# EAGLE design Main (EAGLE 7.5.0)

## Sheet 1 of 2
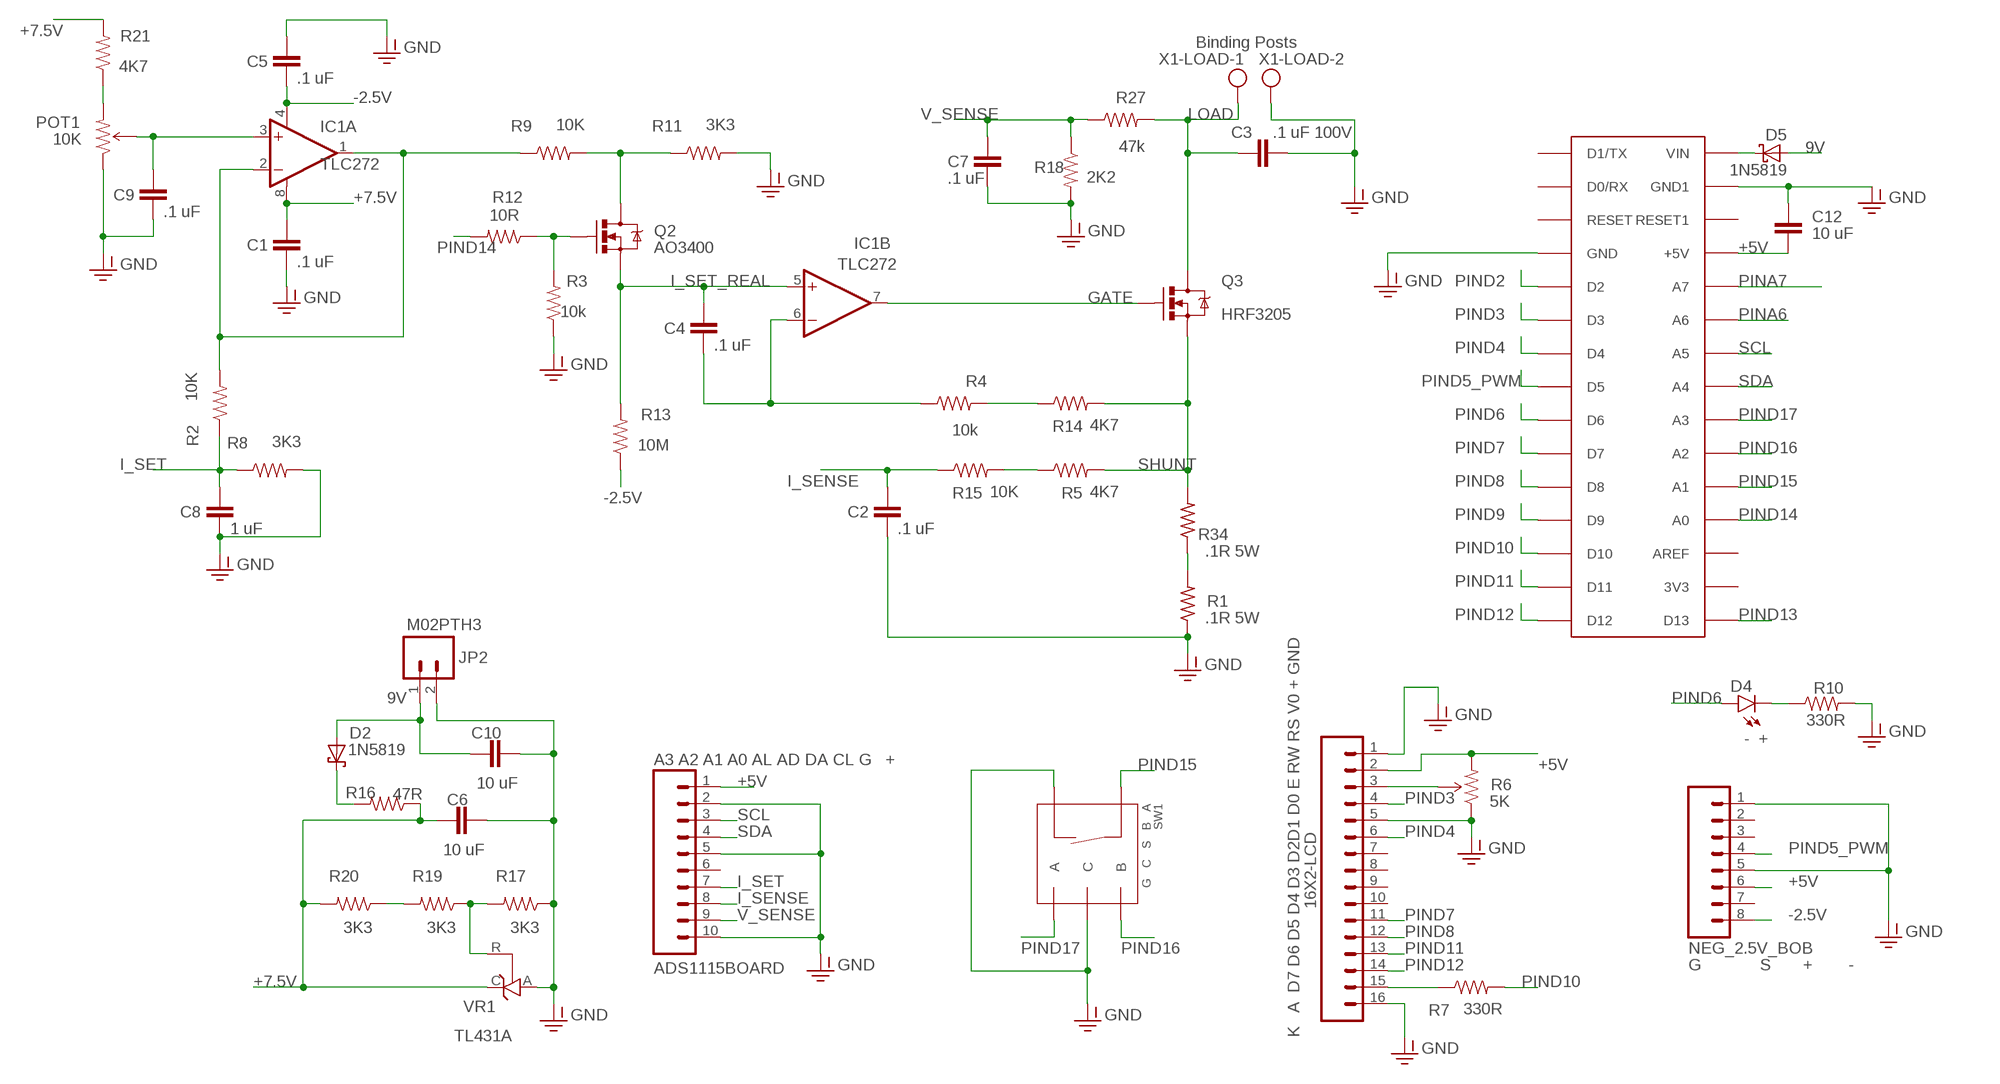
[diagram p0: schematic, sheet 1]

### Parts
16X2-LCD  K A D7 D6 D5 D4 D3 D2D1 D0 E RW RS V0 + GND  M16PTH  [1X16]
ADS1115BOARD  A3 A2 A1 A0 AL AD DA CL G +  M10NO_SILK_PTH_FEMALE  [1X10_NO_SILK]
ARDUINO_NANO  NANO  ARDUINONANO  [PDIP-32]
C1  .1 uF  CAPPTH1  [CAP-PTH-5MM]
C2  .1 uF  CAPPTH1  [CAP-PTH-5MM]
C3  .1 uF 100V  CAPPTH1  [CAP-PTH-5MM]
C4  .1 uF  CAPPTH1  [CAP-PTH-5MM]
C5  .1 uF  CAPPTH1  [CAP-PTH-5MM]
C6  10 uF  CAPPTH1  [CAP-PTH-5MM]
C7  .1 uF  CAPPTH1  [CAP-PTH-5MM]
C8  1 uF  CAPPTH1  [CAP-PTH-5MM]
C9  .1 uF  CAPPTH1  [CAP-PTH-5MM]
C10  10 uF  CAPPTH1  [CAP-PTH-5MM]
C12  10 uF  CAPPTH1  [CAP-PTH-5MM]
D2  1N5819  [DO41-10]
D4  - +  LED5MM  [LED5MM]
D5  1N5819  [DO41-10]
IC1  TLC272  OPAMP-DUALDIP  [DIP08]
JP2  M02PTH3  [1X02_LONGPADS]
NEG_2.5V_BOB  G S + -  M08  [1X08_ROUND]
POT1  10K  TRIMPOT-PTH-KNOB  [3386U]
Q2  AO3400  MOSFET-NCHANNELBSS123LT1G  [SOT23-3]
Q3  HRF3205  MOSFET-NCHANNELFQP30N06L  [TO220V]
R1  .1R 5W  R-US_VTA53  [VTA53]
R2  10K  RESISTORPTH-1/4W  [AXIAL-0.4]
R3  10k  RESISTORPTH-1/4W  [AXIAL-0.4]
R4  10k  RESISTORPTH-1/4W  [AXIAL-0.4]
R5  4K7  RESISTORPTH-1/4W  [AXIAL-0.4]
R6  5K  TRIMPOTPTH  [TRIM_POT_PTH]
R7  330R  RESISTORPTH-1/4W  [AXIAL-0.4]
R8  3K3  RESISTORPTH-1/2W  [AXIAL-0.5]
R9  10K  RESISTORPTH-1/4W  [AXIAL-0.4]
R10  330R  RESISTORPTH-1/4W  [AXIAL-0.4]
R11  3K3  RESISTORPTH-1/4W  [AXIAL-0.4]
R12  10R  RESISTORPTH-1/4W  [AXIAL-0.4]
R13  10M  RESISTORPTH-1/2W  [AXIAL-0.5]
R14  4K7  RESISTORPTH-1/4W  [AXIAL-0.4]
R15  10K  RESISTORPTH-1/2W  [AXIAL-0.5]
R16  47R  RESISTORPTH-1/4W  [AXIAL-0.4]
R17  3K3  RESISTORPTH-1/4W  [AXIAL-0.4]
R18  2K2  RESISTORPTH-1/4W  [AXIAL-0.4]
R19  3K3  RESISTORPTH-1/4W  [AXIAL-0.4]
R20  3K3  RESISTORPTH-1/4W  [AXIAL-0.4]
R21  4K7  RESISTORPTH-1/4W  [AXIAL-0.4]
R27  47k  RESISTORPTH-1/2W  [AXIAL-0.5]
R34  .1R 5W  R-US_VTA53  [VTA53]
SW1  G C S B A  ROTARTY_ENCODERROTARY_ENC_HDR  [1X05]
VR1  TL431A  TL431CLP  [TO92-CLP]
X1-LOAD  Binding Posts  W237-102  [W237-102]

### Nets
9V: C10.1 D2.A D5.A JP2.1 ; also sheet 2
+5V: 16X2-LCD.2 ADS1115BOARD.1 ARDUINO_NANO.+5V C12.1 NEG_2.5V_BOB.6 R6.3(CW) ; also sheet 2
+7.5V: C1.1 C6.1 IC1.8(A:V+) R16.P$1 R20.P$2 R21.P$2 VR1.C ; also sheet 2
-2.5V: C5.2 IC1.4(A:V-) NEG_2.5V_BOB.8 R13.P$1 ; also sheet 2
GATE: IC1.7(B:OUT) Q3.1(G) ; also sheet 2
GND-ISO: 16X2-LCD.1 16X2-LCD.5 16X2-LCD.16 ADS1115BOARD.2 ADS1115BOARD.5 ADS1115BOARD.10 ARDUINO_NANO.GND ARDUINO_NANO.GND1 C1.2 C2.2 C3.2 C5.1 C6.2 C7.2 C8.2 C9.2 C10.2 C12.2 JP2.2 NEG_2.5V_BOB.1 NEG_2.5V_BOB.5 POT1.1(CCW) R1.1 R3.P$1 R6.1(CCW) R8.P$2 R10.P$2 R11.P$2 R17.P$1 R18.P$2 SW1.1(SW-) SW1.2(C) VR1.A X1-LOAD.2 ; supply symbol labelled GND ; also sheet 2
I_SENSE: ADS1115BOARD.8 C2.1 R15.P$1
I_SET: ADS1115BOARD.7 C8.1 R2.P$1 R8.P$1 ; also sheet 2
I_SET_REAL: C4.1 IC1.5(B:+IN) Q2.2(S) R13.P$2 ; also sheet 2
LOAD: C3.1 Q3.2(D) R27.P$2 X1-LOAD.1 ; also sheet 2
N$1: R1.2 R34.1
N$2: 16X2-LCD.15 R7.P$1
N$3: R4.P$2 R14.P$1
N$5: 16X2-LCD.3 R6.2(WIPER)
N$8: C9.1 IC1.3(A:+IN) POT1.2(WIPER)
N$9: D2.C R16.P$2
N$10: IC1.1(A:OUT) IC1.2(A:-IN) R2.P$2 R9.P$1
N$11: ARDUINO_NANO.VIN D5.C
N$13: Q2.3(D) R9.P$2 R11.P$1
N$14: R5.P$1 R15.P$2
N$15: Q2.1(G) R3.P$2 R12.P$1
N$16: D4.K(C) R10.P$1
N$17: POT1.3(CW) R21.P$1
N$18: R17.P$2 R19.P$1 VR1.R
N$19: R19.P$2 R20.P$1
N$23: C4.2 IC1.6(B:-IN) R4.P$1
PINA6: ARDUINO_NANO.A1(A6) ; also sheet 2
PINA7: ARDUINO_NANO.A0(A7) ; also sheet 2
PIND2: ARDUINO_NANO.D2 ; also sheet 2
PIND3: 16X2-LCD.4 ARDUINO_NANO.D3
PIND4: 16X2-LCD.6 ARDUINO_NANO.D4
PIND5_PWM: ARDUINO_NANO.D5 NEG_2.5V_BOB.4
PIND6: ARDUINO_NANO.D6 D4.A
PIND7: 16X2-LCD.11 ARDUINO_NANO.D7
PIND8: 16X2-LCD.12 ARDUINO_NANO.D8
PIND9: ARDUINO_NANO.D9 ; also sheet 2
PIND10: ARDUINO_NANO.D10 R7.P$2
PIND11: 16X2-LCD.13 ARDUINO_NANO.D11
PIND12: 16X2-LCD.14 ARDUINO_NANO.D12
PIND13: ARDUINO_NANO.D13 ; also sheet 2
PIND14: ARDUINO_NANO.A7(A0) R12.P$2
PIND15: ARDUINO_NANO.A6(A1) SW1.3(SW+)
PIND16: ARDUINO_NANO.A5(A2) SW1.4(B)
PIND17: ARDUINO_NANO.A4(A3) SW1.5(A)
SCL: ADS1115BOARD.3 ARDUINO_NANO.A2(A5) ; also sheet 2
SDA: ADS1115BOARD.4 ARDUINO_NANO.A3(A4) ; also sheet 2
SHUNT: Q3.3(S) R5.P$2 R14.P$2 R34.2 ; also sheet 2
V_SENSE: ADS1115BOARD.9 C7.1 R18.P$1 R27.P$1
Unconnected: 16X2-LCD.7 16X2-LCD.8 16X2-LCD.9 16X2-LCD.10 ADS1115BOARD.6 ARDUINO_NANO.3V3 ARDUINO_NANO.AREF ARDUINO_NANO.D0/RX ARDUINO_NANO.D1/TX ARDUINO_NANO.RESET ARDUINO_NANO.RESET1 NEG_2.5V_BOB.2 NEG_2.5V_BOB.3 NEG_2.5V_BOB.7

## Sheet 2 of 2
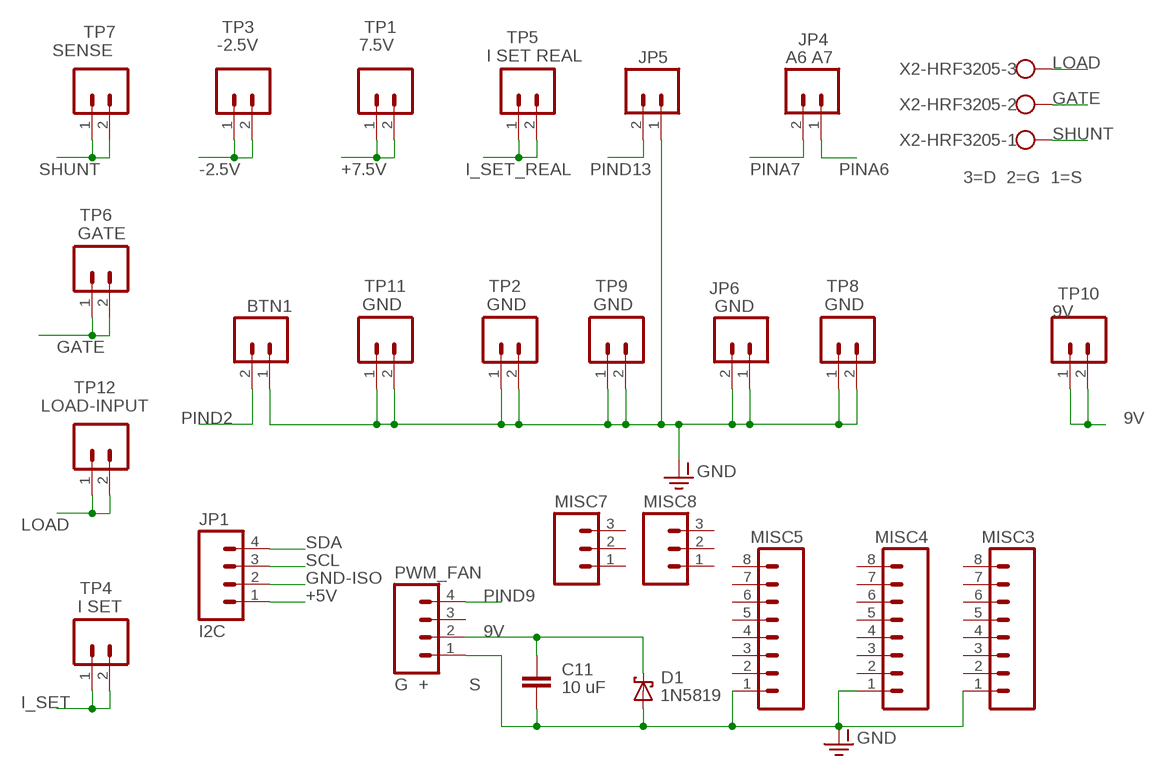
[diagram p1: schematic, sheet 2]

### Parts
BTN1  M02PTH  [1X02]
C11  10 uF  CAPPTH1  [CAP-PTH-5MM]
D1  1N5819  [DO41-10]
JP1  I2C  M04PTH  [1X04]
JP4  A6 A7  M02PTH  [1X02]
JP5  M02PTH  [1X02]
JP6  GND  M02PTH  [1X02]
MISC3  M08  [1X08_ROUND]
MISC4  M08  [1X08_ROUND]
MISC5  M08  [1X08_ROUND]
MISC7  M03PTH  [1X03]
MISC8  M03PTH  [1X03]
PWM_FAN  G + S  M04PTH  [1X04]
TP1  7.5V  M02PTH  [1X02]
TP2  GND  M02PTH3  [1X02_LONGPADS]
TP3  -2.5V  M02PTH  [1X02]
TP4  I SET  M02PTH3  [1X02_LONGPADS]
TP5  I SET REAL  M02PTH3  [1X02_LONGPADS]
TP6  GATE  M02PTH3  [1X02_LONGPADS]
TP7  SENSE  M02PTH3  [1X02_LONGPADS]
TP8  GND  M02PTH3  [1X02_LONGPADS]
TP9  GND  M02PTH3  [1X02_LONGPADS]
TP10  9V  M02PTH  [1X02]
TP11  GND  M02PTH3  [1X02_LONGPADS]
TP12  LOAD-INPUT  M02PTH3  [1X02_LONGPADS]
X2-HRF3205  3=D 2=G 1=S  W237-103  [W237-103]

### Nets
9V: C11.2 D1.C PWM_FAN.2 TP10.1 TP10.2 ; also sheet 1
+5V: JP1.1 ; also sheet 1
+7.5V: TP1.1 TP1.2 ; also sheet 1
-2.5V: TP3.1 TP3.2 ; also sheet 1
GATE: TP6.1 TP6.2 X2-HRF3205.2 ; also sheet 1
GND-ISO: BTN1.1 C11.1 D1.A JP1.2 JP5.1 JP6.1 JP6.2 MISC3.1 MISC4.1 MISC5.1 PWM_FAN.1 TP2.1 TP2.2 TP8.1 TP8.2 TP9.1 TP9.2 TP11.1 TP11.2 ; supply symbol labelled GND ; also sheet 1
I_SET: TP4.1 TP4.2 ; also sheet 1
I_SET_REAL: TP5.1 TP5.2 ; also sheet 1
LOAD: TP12.1 TP12.2 X2-HRF3205.3 ; also sheet 1
PINA6: JP4.1 ; also sheet 1
PINA7: JP4.2 ; also sheet 1
PIND2: BTN1.2 ; also sheet 1
PIND9: PWM_FAN.4 ; also sheet 1
PIND13: JP5.2 ; also sheet 1
SCL: JP1.3 ; also sheet 1
SDA: JP1.4 ; also sheet 1
SHUNT: TP7.1 TP7.2 X2-HRF3205.1 ; also sheet 1
Unconnected: MISC3.2 MISC3.3 MISC3.4 MISC3.5 MISC3.6 MISC3.7 MISC3.8 MISC4.2 MISC4.3 MISC4.4 MISC4.5 MISC4.6 MISC4.7 MISC4.8 MISC5.2 MISC5.3 MISC5.4 MISC5.5 MISC5.6 MISC5.7 MISC5.8 MISC7.1 MISC7.2 MISC7.3 MISC8.1 MISC8.2 MISC8.3 PWM_FAN.3

## Library data of the parts
16X2-LCD = SparkFun-Connectors:M16: 1x16 .1" header
ADS1115BOARD = SparkFun-Connectors:M10: Header 10 Standard 10-pin 0.1" header. Use with straight break away headers (SKU : PRT-00116), right angle break away headers (PRT-00553), swiss pins (PRT-00743), machine pins (PRT-00117), and female headers (PRT-00115).; PROD_ID: CONN-11563
ARDUINO_NANO = Ardiuno-Nano:ARDUINONANO: NAN0
BTN1 JP2 JP4-JP6 TP1-TP12 = SparkFun-Connectors:M02: Standard 2-pin 0.1" header. Use with - straight break away headers ( PRT-00116) - right angle break away headers (PRT-00553) - swiss pins (PRT-00743) - machine pins (PRT-00117) - female headers (PRT-00115) Molex polarized connector foot print use with: PRT-08233 with associated crimp pins and housings. 2.54_SCREWTERM for use with PRT-10571. 3.5mm Screw Terminal footprints for PRT-08084 5mm Screw Terminal footprints for use with PRT-08432
C1-C12 = SparkFun-Capacitors:CAP: Capacitor Standard 0603 ceramic capacitor, and 0.1" leaded capacitor.
D1 D2 D5 = diode:1N581*: 1.0A SCHOTTKY BARRIER RECTIFIER Source: http://www.diodes.com/datasheets/ds23001.pdf
D4 = SparkFun-LED:LED: LEDs Standard schematic elements and footprints for 5mm, 3mm, 1206, and 0603 sized LEDs. 5mm - Spark Fun Electronics SKU : COM-00529 (and others)
IC1 = SparkFun-AnalogIC:OPAMP-DUAL: Generic op-amp footprint
JP1 PWM_FAN = SparkFun-Connectors:M04: Header 4 Standard 4-pin 0.1" header. Use with straight break away headers (SKU : PRT-00116), right angle break away headers (PRT-00553), swiss pins (PRT-00743), machine pins (PRT-00117), and female headers (PRT-00115). Molex polarized connector foot print use with SKU : PRT-08231 with associated crimp pins and housings. 1MM SMD Version SKU: PRT-10208
MISC3-MISC5 NEG_2.5V_BOB = SparkFun-Connectors:M08: Header 8 Standard 8-pin 0.1" header. Use with straight break away headers (SKU : PRT-00116), right angle break away headers (PRT-00553), swiss pins (PRT-00743), machine pins (PRT-00117), and female headers (PRT-00115).
MISC7 MISC8 = AAA_MY_LIB:M03: Header 3 Standard 3-pin 0.1" header. Use with straight break away headers (SKU : PRT-00116), right angle break away headers (PRT-00553), swiss pins (PRT-00743), machine pins (PRT-00117), and female headers (PRT-00115). Molex polarized connector foot print use with SKU : PRT-08232 with associated crimp pins and housings.
POT1 R6 = SparkFun-Electromechanical:TRIMPOT: Various small potentiometers for "set-and-forget" applications
Q2 = SparkFun-DiscreteSemi:MOSFET-NCHANNEL: Common NMOSFET Parts MFG P/N Store ID Prod ID FDD8780 TRANS-09984 SI7820DN TRANS-11055 FDS6630A IC-08089 2N7002PW TRANS-11151 FQP30N06L COM-10213 TRANS-10060 BSS123LT1G TRANS-08345 BSS138 TRANS-00830 BS170 2N7000; PROD_ID: TRANS-08345
Q3 = SparkFun-DiscreteSemi:MOSFET-NCHANNEL: Common NMOSFET Parts MFG P/N Store ID Prod ID FDD8780 TRANS-09984 SI7820DN TRANS-11055 FDS6630A IC-08089 2N7002PW TRANS-11151 FQP30N06L COM-10213 TRANS-10060 BSS123LT1G TRANS-08345 BSS138 TRANS-00830 BS170 2N7000; PROD_ID: TRANS-10060
R1 R34 = resistor:R-US_: RESISTOR, American symbol
R2-R5 R7-R21 R27 = SparkFun-Resistors:RESISTOR: Resistor Basic schematic elements and footprints for 0603, 1206, and PTH resistors.
SW1 = AAA_MY_LIB:ROTARTY_ENCODER: Simple no LED rotary encoder Example: COM-09117
VR1 = v-reg:TL431CLP: VOLTAGE REGULATOR
X1-LOAD = con-wago-500:W237-102: WAGO SCREW CLAMP; MPN: 237-102; OC_FARNELL: unknown; OC_NEWARK: 70K9898
X2-HRF3205 = con-wago-500:W237-103: WAGO SCREW CLAMP; MPN: 237-103; OC_FARNELL: unknown; OC_NEWARK: 18M7116

## Board
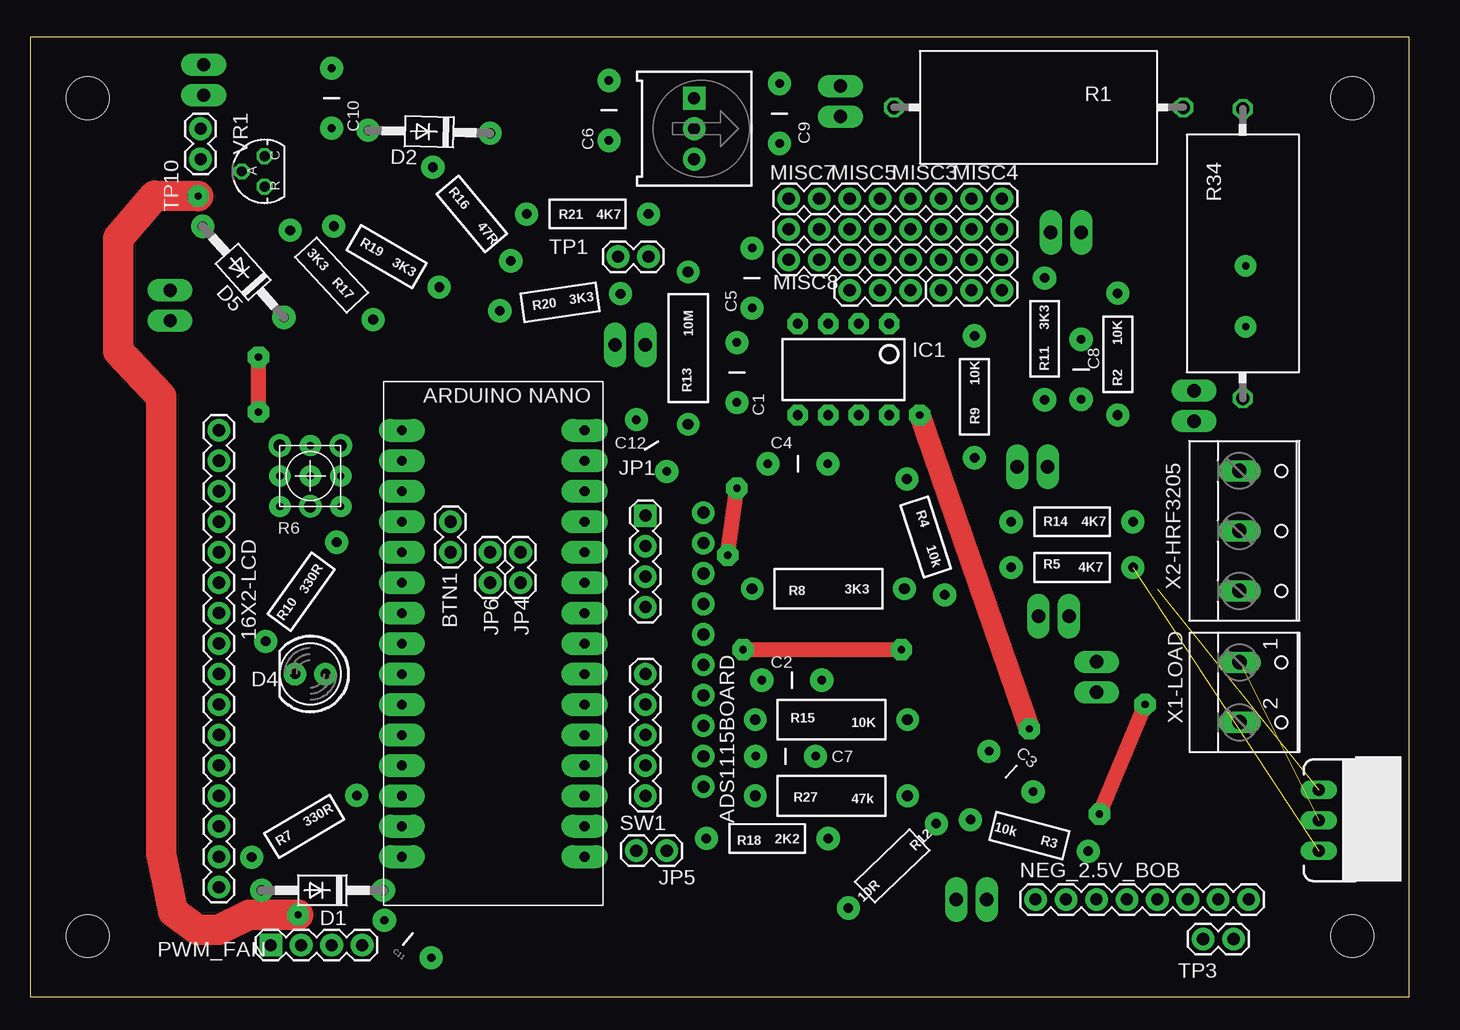
[diagram p2: board, top side]
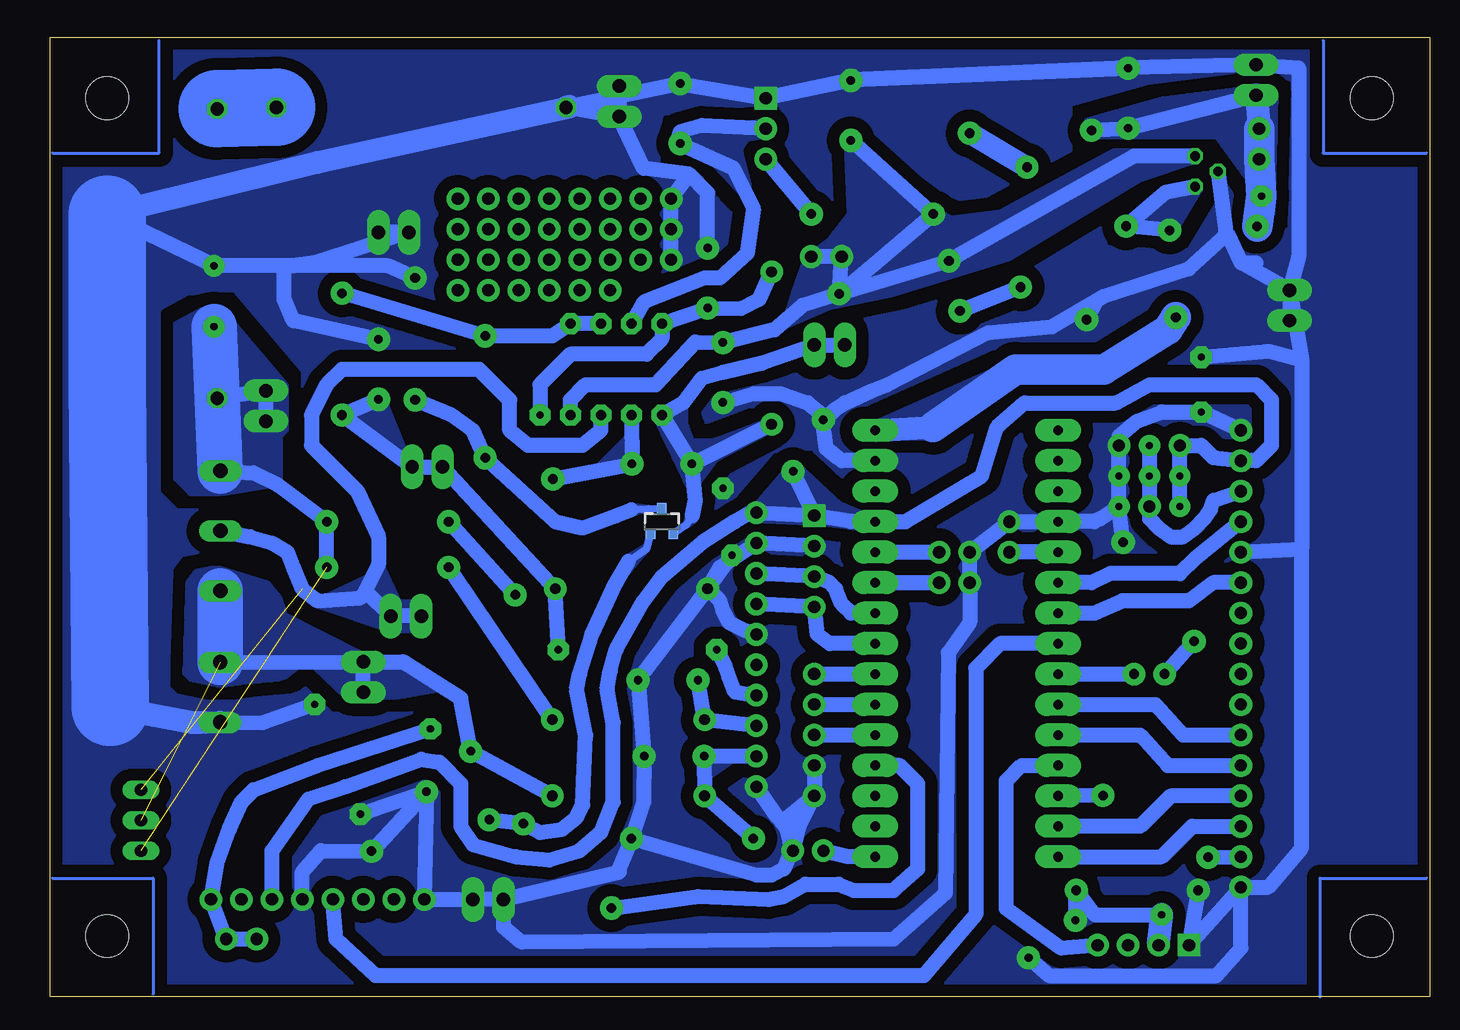
[diagram p3: board, bottom side, seen from below]

Size 114.99 x 80 mm. Coordinates in mm from the lower left corner, seen from the top.
Outline: 0,0 114.99,0 114.99,80 0,80 0,0
Copper layers (1*16): Top 0.035mm / dielectric 1.5mm / Bottom 0.035mm
Design rules "default": minimum track width 10mil, minimum drill 24mil, track to track 8mil, track to pad 8mil, pad to pad 8mil, via to via 8mil, smd to smd 8mil, copper to edge 40mil, drill to drill 8mil, minimum pad ring 10mil, minimum via ring 8mil, stop-mask expansion 4mil, vias tented up to drill 0mil, thermal gap 10mil
Holes 3.56 mm at 110.24,5.08 110.24,74.93 4.83,5.08 4.83,74.93

### Footprints (pad centres in the part's own frame; a part is rotated, then mirrored left to right if it is on the bottom)
1X16 = drill 1.016 pad 1.88: 1 0,0; 2 2.54,0; 3 5.08,0; 4 7.62,0; 5 10.16,0; 6 12.7,0; 7 15.24,0; 8 17.78,0; 9 20.32,0; 10 22.86,0; 11 25.4,0; 12 27.94,0; 13 30.48,0; 14 33.02,0; 15 35.56,0; 16 38.1,0
1X10_NO_SILK = drill 1.016 pad 1.88: 1 0,0; 2 2.54,0; 3 5.08,0; 4 7.62,0; 5 10.16,0; 6 12.7,0; 7 15.24,0; 8 17.78,0; 9 20.32,0; 10 22.86,0
PDIP-32 = drill 0.8 pad 1.93 long: 3V3 15.24,-35.56; +5V 15.24,-10.16; A0 15.24,-12.7; A1 15.24,-15.24; A2 15.24,-17.78; A3 15.24,-20.32; A4 15.24,-22.86; A5 15.24,-25.4; A6 15.24,-27.94; A7 15.24,-30.48; AREF 15.24,-33.02; D0/RX 0,-5.08; D1/TX 0,-2.54; D2 0,-12.7; D3 0,-15.24; D4 0,-17.78; D5 0,-20.32; D6 0,-22.86; D7 0,-25.4; D8 0,-27.94; D9 0,-30.48; D10 0,-33.02; D11 0,-35.56; D12 0,-38.1; D13 15.24,-38.1; GND 0,-10.16; GND1 15.24,-5.08; RESET 0,-7.62; RESET1 15.24,-7.62; VIN 15.24,-2.54
1X02 = drill 1.016 pad 1.88: 1 0,0; 2 2.54,0
CAP-PTH-5MM = drill 0.7 pad 1.93: 1 -2.5,0; 2 2.5,0
DO41-10 = drill 0.8 pad 1.93: A 5.08,0; C -5.08,0
LED5MM = drill 0.813 pad 1.88: A -1.27,0; K 1.27,0
DIP08 = drill 0.813 pad 1.727 octagon: 1 -3.81,-3.81; 2 -1.27,-3.81; 3 1.27,-3.81; 4 3.81,-3.81; 5 3.81,3.81; 6 1.27,3.81; 7 -1.27,3.81; 8 -3.81,3.81
1X04 = drill 1.016 pad 1.88 square: 1 0,0 | drill 1.016 pad 1.88: 2 2.54,0; 3 5.08,0; 4 7.62,0
1X02_LONGPADS = drill 1.118 pad 1.88 long: 1 0,0; 2 2.54,0
1X08_ROUND = drill 1.016 pad 1.88: 1 0,0; 2 2.54,0; 3 5.08,0; 4 7.62,0; 5 10.16,0; 6 12.7,0; 7 15.24,0; 8 17.78,0
1X03 = drill 1.016 pad 1.88: 1 0,0; 2 2.54,0; 3 5.08,0
3386U = drill 1.016 pad 1.88 square: 1 -2.54,-0.015 | drill 1.016 pad 1.88: 2 0,-0.015; 3 2.54,-0.015
SOT23-3 = smd 0.8 x 0.9: 1 -0.95,-1; 2 0.95,-1; 3 0,1.1
TO220V = drill 1.016 long: 1 -2.54,0; 2 0,0; 3 2.54,0
VTA53 = drill 1.1 octagon: 1 -12.065,0; 2 12.065,0
AXIAL-0.4 = drill 0.8 pad 1.93: P$1 -5.08,0; P$2 5.08,0
TRIM_POT_PTH = drill 1 pad 1.88: 1 -2.54,-2.54; 2 0,2.54; 3 2.54,-2.54
AXIAL-0.5 = drill 0.9 pad 1.88: P$1 -6.35,0; P$2 6.35,0
1X05 = drill 1.016 pad 1.88: 1 0,0; 2 2.54,0; 3 5.08,0; 4 7.62,0; 5 10.16,0
TO92-CLP = drill 0.813 octagon: A 0,1.905; C 1.27,0; R -1.27,0
W237-102 = drill 1.194 long: 1 -2.5,-1.27; 2 2.5,-1.27
W237-103 = drill 1.194 long: 1 -5,-1.29; 2 0,-1.29; 3 5,-1.29

### Placement (x,y rotation side)
16X2-LCD  15.75,47.24 270 top
ADS1115BOARD  56.13,40.39 270 top
ARDUINO_NANO  30.99,49.78 0 top
BTN1  35.05,39.62 270 top
C1  58.93,52.07 270 top
C2  63.5,26.42 0 top
C3  81.79,18.8 317.5 top
C4  64.01,44.45 0 top
C5  60.2,59.94 270 top
C6  48.26,73.91 90 top
C7  62.99,20.07 0 top
C8  87.63,52.32 90 top
C9  62.48,73.66 90 top
C10  25.15,74.93 90 top
C11  31.5,4.83 141.3 top
C12  51.82,45.97 120.3 top
D1  24.38,8.89 180 top
D2  33.27,72.14 178.6 top
D4  23.37,26.92 180 top
D5  17.78,60.45 131.8 top
IC1  67.82,52.32 180 top
JP1  51.31,40.13 270 top
JP2  14.48,75.18 90 top
JP4  40.89,34.54 90 top
JP5  53.09,12.19 180 top
JP6  38.35,34.54 90 top
MISC3  63.25,66.55 0 top
MISC4  63.25,64.01 0 top
MISC5  63.25,61.47 0 top
MISC7  75.95,58.93 0 top
MISC8  68.33,58.93 0 top
NEG_2.5V_BOB  83.82,8.13 0 top
POT1  55.37,72.39 270 top
PWM_FAN  20.07,4.32 0 top
Q2  64.01,39.62 0 bottom
Q3  107.44,14.73 270 top
R1  84.07,74.17 0 top
R2  90.68,53.59 90 top
R3  83.31,13.46 165 top
R4  74.68,38.35 288 top
R5  86.87,35.81 0 top
R6  23.37,43.43 180 top
R7  22.86,14.22 30.5 top
R8  66.55,34.04 180 top
R9  78.74,50.04 270 top
R10  22.61,33.78 54.4 top
R11  84.58,54.86 90 top
R12  71.88,10.92 223.8 top
R13  54.86,54.1 270 top
R14  86.87,39.62 0 top
R15  66.8,23.11 0 top
R16  36.83,65.28 129.8 top
R17  25.15,60.2 132.9 top
R18  61.47,13.21 359.9 top
R19  29.72,61.72 330 top
R20  44.2,57.91 8.1 top
R21  46.48,65.28 180 top
R27  66.8,16.76 0 top
R34  101.09,61.98 270 top
SW1  51.31,16.76 90 top
TP1  51.56,61.72 180 top
TP2  87.63,63.75 180 top
TP3  97.79,4.83 0 top
TP4  82.3,44.2 0 top
TP5  51.31,54.36 180 top
TP6  84.07,31.75 0 top
TP7  97.03,48.01 90 top
TP8  11.68,56.39 90 top
TP9  77.22,8.13 0 top
TP10  14.22,69.85 90 top
TP11  67.56,73.41 90 top
TP12  88.9,25.4 90 top
VR1  19.56,68.83 90 top
X1-LOAD  102.11,25.4 270 top
X2-HRF3205  102.11,38.86 270 top

### Tracks (layer width: path | path; a pad name or v marks a point on that pad's centre or on a via)
9V  (via drill 0.6 pad 1.78)
  Top 2.54: v22.35,6.86 18.29,6.86 15.75,5.59 13.97,5.59 11.94,7.11 10.92,11.94 10.92,50.04 7.37,53.85 7.37,63.25 10.41,66.8 v14.03,66.76
  Bottom 1.27: v22.35,6.86 27.94,6.86 D1.C C11.2 | D2.A C10.1 JP2.1
  Bottom 1.93: JP2.1 TP10.2 | PWM_FAN.2 v22.35,6.86
  Bottom 2.54: TP10.2 TP10.1 v14.03,66.76 D5.A
  pour Bottom (no thermals): 29.97,8.64 29.97,5.84 29.46,5.59 27.94,6.35
  pour Bottom (no thermals): 14.48,75.95 22.35,74.93 28.7,73.15 28.7,71.63 17.78,71.63 14.99,67.82 14.99,64.26 12.95,65.28 12.7,75.18
+5V  (via drill 0.6 pad 1.78)
  Bottom 1.27: NEG_2.5V_BOB.6 96.52,12.19 93.47,16.51 90.42,17.53 84.07,19.81 82.55,19.56 80.77,17.78 80.77,14.22 79.76,12.7 76.2,11.68 73.41,11.43 70.87,12.19 69.09,13.72 68.07,16.26 68.07,22.86 68.58,25.65 68.33,27.18 67.82,28.96 65.53,33.02 64.01,35.05 60.71,37.85 57.91,39.62 56.64,40.39 ADS1115BOARD.1 JP1.1 | v20.83,40.89 v20.83,43.43 R6.3 19.05,45.97 18.03,44.96 16X2-LCD.2 14.48,44.7 13.21,45.97 13.21,49.78 14.48,51.05 16.26,51.05 23.37,51.05 26.16,49.53 33.78,49.53 36.07,47.5 37.34,43.43 43.69,39.62 ARDUINO_NANO.+5V 48.26,39.62 JP1.1 | C12.1 JP1.1
  pour Bottom (no thermals): 53.59,44.2 56.64,40.64 56.39,39.62 50.8,39.37 46.48,38.86 47.24,40.39 49.02,41.15 52.58,44.45
+7.5V
  Bottom 1.27: C6.1 R21.P$2 R20.P$2 | R20.P$2 R16.P$1 24.64,70.1 VR1.C | IC1.8 71.63,49.78 70.36,51.05 64.52,51.05 61.21,54.61 C1.1 54.61,55.63 52.32,57.66 R20.P$2 | R20.P$2 TP1.2 TP1.1
  pour Bottom (no thermals): 48.77,71.12 48.51,65.28 50.04,63.25 52.07,61.72 53.09,58.93 54.1,55.63 50.04,57.4 44.96,58.42 35.05,61.47 24.13,68.07 19.56,69.6 19.56,70.61 26.42,70.61 35.81,65.53 39.88,65.02 41.4,65.79
-2.5V  (via drill 0.6 pad 1.78)
  Top 1.778: v83.31,22.35 v74.17,48.51
  Bottom 1.27: v74.17,48.51 74.17,51.05 71.63,53.59 65.28,53.59 64.01,54.86 IC1.4 C5.2 57.4,57.4 55.88,58.17 R13.P$1 | v83.31,22.35 92.71,19.3 98.04,17.27 99.06,16.26 100.08,13.97 101.09,11.18 NEG_2.5V_BOB.8 TP3.2 TP3.1
GATE  (1 unrouted)
  Bottom 1.27: 88.9,33.53 87.63,36.07 87.63,38.35 89.41,42.16 93.22,45.97 93.22,48.51 91.95,51.05 90.68,52.32 79.25,52.32 76.71,49.78 76.71,47.24 75.18,45.97 70.61,45.97 69.09,47.24 IC1.7 | X2-HRF3205.2 98.3,38.35 96.52,37.85 95.25,37.08 94.74,35.81 93.98,34.04 92.71,33.02 89.15,33.27 88.9,33.53 | 88.9,33.53 88.65,33.78 TP6.2 TP6.1
  pour Bottom (no thermals): 92.71,32.51 86.61,30.48 84.07,30.48 84.07,33.02 85.85,33.02 87.12,35.81 91.95,33.53
GND-ISO  (via drill 0.6 pad 1.78)
  Top 1.27: v89.15,15.24 v92.96,24.38 | v19.05,48.77 v19.05,53.34 | v58.17,36.83 v58.93,42.42
  Bottom 1.27: 10.67,53.09 13.46,53.85 v19.05,53.34 | 10.67,53.09 10.67,37.34 | 16X2-LCD.5 10.67,37.34 | VR1.A 17.02,63.75 16.89,63.63 | 16.89,63.63 15.75,61.21 | 15.75,61.21 14.48,61.21 | C3.2 NEG_2.5V_BOB.1 TP9.2 TP9.1 | 71.72,74.24 C9.2 POT1.1 C6.2 | ADS1115BOARD.2 56.39,37.85 | C3.2 v89.15,15.24 | v92.96,24.38 97.28,22.86 X1-LOAD.2 | 16X2-LCD.16 13.46,9.14 10.67,12.45 10.67,37.34 | 16X2-LCD.1 v19.05,48.77 22.35,48.77 24.38,48.01 25.91,46.74 R6.1 v25.91,43.43 v25.91,40.89 | TP2.1 TP2.2 92.96,61.21 94.74,60.96 | TP8.2 10.92,61.72 10.92,77.47 JP2.2 25.15,77.47 48.26,76.45 C10.2 | TP8.2 TP8.1 | TP8.2 10.67,53.09 | ARDUINO_NANO.GND1 49.02,44.7 49.33,44.95 50.29,45.72 50.55,47.5 50.37,48.03 | v25.91,40.89 27.43,39.88 27.94,39.62 ARDUINO_NANO.GND BTN1.1 JP6.2 JP6.1 38.35,31.24 40.13,28.7 40.39,8.64 44.7,4.83 75.69,4.57 77.22,5.84 TP9.1 | ADS1115BOARD.5 56.9,30.48 58.42,31.24 58.93,32.26 59.18,33.02 R8.P$2 | TP11.2 TP11.1 | TP11.1 R1.1 | JP1.2 ADS1115BOARD.2 | 50.37,48.03 50.29,48.26 | 50.29,48.26 49.53,49.02 48.77,49.53 46.48,50.55 45.21,51.05 36.83,55.37 31.5,55.88 27.78,58.07 | C1.2 56.39,50.29 54.1,50.29 51.82,49.53 50.29,48.26 | v58.17,36.83 R8.P$2 | 110.24,65.28 v101.35,60.96 95.5,60.96 | SW1.2 SW1.1 | R18.P$2 65.53,16.26 C7.2 C2.2 R8.P$2 | ADS1115BOARD.10 54.36,14.99 54.02,14.54 | 54.02,14.54 53.59,13.97 53.34,12.95 53.34,11.94 53.85,10.67 54.86,10.16 56.13,10.16 R18.P$2 | SW1.1 54.02,14.54 | TP9.1 67.69,10.38 | 67.69,10.38 67.56,10.41 | C3.2 R3.P$1 92.46,12.19 93.98,10.41 NEG_2.5V_BOB.5 | 94.74,60.96 95.5,60.96 | R11.P$2 86.87,60.96 94.74,60.96 | TP8.2 15.75,61.21 | C5.1 60.2,67.06 61.72,68.58 | 61.72,68.58 65.53,69.09 TP11.1
  Bottom 1.27: 61.72,68.58 MISC3.1 MISC4.1 MISC5.1 | R18.P$2 67.69,10.38 | R10.P$2 v25.91,40.89 | JP5.1 52.58,14.22 SW1.1 | 27.78,58.07 27.18,58.42 20.07,60.71 16.89,63.63 | R17.P$1 27.78,58.07 | C8.2 94.74,56.39 95.5,58.17 95.5,60.96 | R8.P$2 59.18,35.81 ADS1115BOARD.2 | 16X2-LCD.16 PWM_FAN.1 D1.A | C11.1 31.75,1.78 17.78,1.78 15.75,4.06 16X2-LCD.16 | C12.2 50.37,48.03
  Bottom 1.93: 110.24,65.28 92.71,69.6 71.73,74.19 71.72,74.24 R1.1 | X1-LOAD.2 102.62,22.86 103.12,22.86 109.98,24.13
  Bottom 6.452: 109.98,24.13 110.24,51.31 110.24,65.28
  pour Bottom (isolate 1.016, rank 3, no thermals): 0.25,0.25 114.55,0.25 114.55,79.76 0.51,79.76 0.51,0.76
I_SENSE
  Bottom 1.27: ADS1115BOARD.8 R15.P$1 C2.1
I_SET  (via drill 0.6 pad 1.78)
  Top 1.27: v59.44,28.96 v72.64,28.96
  Bottom 1.27: ADS1115BOARD.7 56.39,25.15 57.91,25.4 58.42,26.67 58.67,27.43 v59.44,28.96 | v72.64,28.96 R8.P$1 TP4.1 TP4.2 R2.P$1 C8.1
  pour Bottom (no thermals): 85.09,44.96 87.12,50.04 90.42,48.51 85.6,44.96
I_SET_REAL
  Bottom 0.61: 61.47,40.13 61.98,39.37 Q2.2
  Bottom 1.27: C4.1 IC1.5 62.23,49.53 60.71,51.56 58.93,52.07 55.63,52.83 TP5.1 TP5.2 | R13.P$2 C4.1 | 61.47,40.13 61.21,41.4 C4.1
  pour Bottom (no thermals): 61.72,42.16 64.52,48.01 61.98,49.78 61.98,47.75 61.47,46.48 59.69,46.48 55.63,48.01 55.12,46.99 59.44,44.7 60.96,42.67
  pour Bottom: 62.23,39.12 61.72,40.89 60.96,40.13 61.21,39.62 61.98,39.12
LOAD  (1 unrouted)
  Bottom 1.27: X1-LOAD.1 TP12.2 | TP12.1 TP12.2 | TP12.2 85.6,27.94 80.77,24.89 C3.1 R27.P$2
  Bottom 3.81: X2-HRF3205.3 X1-LOAD.1
  pour Bottom (no thermals): 100.84,35.81 101.6,35.81 102.87,35.56 103.63,34.54 103.89,26.92 103.38,26.42 100.84,25.91 98.81,26.16 96.01,26.42 95.25,26.67 94.23,27.43 94.23,28.45 95.76,33.27 96.77,34.54
  pour Bottom (no thermals): 95.5,32 88.9,28.7 81.79,25.65 86.11,24.89 90.42,24.89 95.5,29.72
N$1
  Bottom 6.452: R34.1 R1.2
N$2
  Bottom 1.27: R7.P$1 16X2-LCD.15
N$3
  Bottom 1.27: R14.P$1 R4.P$2
N$4
  Bottom 0.254: 8.89,79.76 8.89,70.36 0.25,70.36
N$5  (via drill 0.6 pad 1.78)
  Bottom 1.27: v23.37,45.97 v23.37,43.43 | v23.37,43.43 R6.2 | v23.37,43.43 23.37,39.88 22.61,39.12 21.59,38.35 20.57,38.35 19.56,39.12 18.8,39.88 18.29,40.64 18.03,41.4 16X2-LCD.3
N$6
  Bottom 0.254: 9.14,0 9.14,9.91 0.25,9.91
N$7
  Bottom 0.254: 114.81,70.36 105.92,70.36 105.92,79.76
N$8
  Bottom 1.27: IC1.3 65.53,57.91 60.45,59.94 59.18,59.94 56.9,61.98 56.39,65.79 58.07,69.12 C9.1 62.74,71.37 62.48,72.14 60.71,72.64 POT1.2
  pour Bottom (no thermals): 55.37,71.63 56.9,71.37 57.4,70.61 56.64,67.56 57.15,66.55 60.71,70.36 62.99,70.61 62.74,72.39 55.37,73.15
N$9
  Bottom 1.778: D2.C R16.P$2
N$10
  Bottom 1.27: IC1.2 IC1.1 73.15,55.12 R9.P$1 R2.P$2
N$11
  Bottom 1.93: ARDUINO_NANO.VIN 41.4,47.5
  Bottom 2.54: 41.4,47.5 34.54,52.32 27.18,52.32 21.84,55.63 D5.C
  pour Bottom (no thermals): 46.74,47.75 35.31,52.83 42.93,47.24 41.4,46.48 46.23,46.48
N$12
  Bottom 0.254: 114.81,9.91 106.43,9.91 106.43,0.25
N$13
  Bottom 0.61: 66.55,40.64 Q2.3
  Bottom 1.27: 66.55,40.64 67.82,40.13 70.61,39.12 72.9,39.62 78.49,44.7 R9.P$2 79.76,47.24 81.53,48.51 R11.P$1
  pour Bottom (no thermals): 66.55,41.15 64.77,40.89 64.77,40.64 66.55,40.13
N$14
  Bottom 1.27: R5.P$1 R15.P$2
N$15
  Bottom 0.61: 66.8,36.32 65.28,37.34 Q2.1
  Bottom 1.27: 66.8,36.32 67.82,34.54 69.85,30.23 70.87,26.92 71.12,25.65 70.36,21.84 70.61,16 71.12,14.99 72.39,13.97 74.17,13.72 R12.P$1 R3.P$2
  pour Bottom: 65.53,37.59 66.8,36.83 66.8,35.31 65.28,37.08 64.77,38.35 65.28,37.59
N$16
  Bottom 1.27: D4.K R10.P$1
N$17
  Bottom 1.27: POT1.3 R21.P$1
N$18
  Bottom 1.27: VR1.R 22.1,67.06 R19.P$1 R17.P$2
  pour Bottom (no thermals): 19.05,67.31 21.34,63.5 25.65,63.75 25.91,64.52 21.84,67.56
N$19
  Bottom 1.27: R19.P$2 R20.P$1
N$23
  Bottom 1.27: IC1.6 C4.2 R4.P$1
  pour Bottom (no thermals): 66.29,46.48 67.31,44.2 70.1,43.69 66.8,46.99
PINA6
  Bottom 1.27: ARDUINO_NANO.A1 JP4.1
PINA7
  Bottom 1.27: ARDUINO_NANO.A0 JP4.2
PIND2
  Bottom 1.27: ARDUINO_NANO.D2 BTN1.2
PIND3
  Bottom 1.27: 16X2-LCD.4 19.56,36.58 20.83,35.31 26.67,35.31 28.19,34.54 ARDUINO_NANO.D3
PIND4
  Bottom 1.27: ARDUINO_NANO.D4 27.94,32 25.65,33.02 20.07,33.02 18.03,34.54 16X2-LCD.6
PIND5_PWM
  Bottom 1.27: NEG_2.5V_BOB.4 91.19,4.83 87.88,1.78 42.16,1.78 37.85,6.86 37.85,27.43 35.81,29.46 ARDUINO_NANO.D5
PIND6
  Bottom 1.27: ARDUINO_NANO.D6 D4.A
PIND7
  Bottom 1.27: ARDUINO_NANO.D7 22.86,24.38 20.57,21.84 16X2-LCD.11
PIND8
  Bottom 1.27: ARDUINO_NANO.D8 24.13,21.84 21.84,19.3 16X2-LCD.12
PIND9
  Bottom 1.27: PWM_FAN.4 30.73,4.06 35.31,7.37 35.31,18.03 34.04,19.3 ARDUINO_NANO.D9
PIND10
  Bottom 1.27: R7.P$2 ARDUINO_NANO.D10
PIND11
  Bottom 1.27: 16X2-LCD.13 21.59,16.76 24.13,14.22 ARDUINO_NANO.D11
PIND12
  Bottom 1.27: ARDUINO_NANO.D12 22.35,11.68 19.81,14.22 16X2-LCD.14
PIND13
  Bottom 1.27: ARDUINO_NANO.D13 48.51,11.68 JP5.2
PIND14
  Bottom 1.27: ARDUINO_NANO.A7 44.2,19.3 42.67,17.78 42.67,10.67 44.7,8.89 48.01,8.89 49.28,9.4 52.07,9.4 53.85,8.38 55.12,8.13 60.96,8.38 R12.P$2
PIND15
  Bottom 1.27: SW1.3 ARDUINO_NANO.A6
PIND16
  Bottom 1.27: SW1.4 ARDUINO_NANO.A5
PIND17
  Bottom 1.27: SW1.5 ARDUINO_NANO.A4
SCL
  Bottom 1.27: ADS1115BOARD.3 JP1.3 50.04,34.54 49.53,34.04 49.02,32.77 48.26,32 ARDUINO_NANO.A2
SDA
  Bottom 1.27: ADS1115BOARD.4 JP1.4 51.05,30.23 50.04,29.46 ARDUINO_NANO.A3
SHUNT  (via drill 0.6 pad 1.78)  (1 unrouted)
  Bottom 1.27: R5.P$2 R14.P$2 96.01,42.67 98.04,43.69 X2-HRF3205.1 | TP7.1 TP7.2 R34.2
  Bottom 3.81: X2-HRF3205.1 R34.2 v101.35,55.88
  pour Bottom (no thermals): 100.84,57.66 95.25,51.05 95.25,47.75 99.57,43.18 101.85,42.67 103.12,43.94 103.12,56.9 101.85,57.4
  pour Bottom (no thermals): 100.84,57.66 95.25,51.05 95.25,47.75 99.57,43.18 101.85,42.67 103.12,43.94 103.12,56.9 101.85,57.4
  pour Bottom (no thermals): 100.84,57.15 95.25,50.55 95.25,47.24 99.57,42.67 101.85,42.16 103.12,43.43 103.12,56.39 101.85,56.9
  pour Bottom (no thermals): 100.84,57.4 95.25,50.8 95.25,47.5 99.57,42.93 101.85,42.42 103.12,43.69 103.12,56.64 101.85,57.15
  pour Bottom (no thermals): 100.84,57.66 95.25,51.05 95.25,47.75 99.57,43.18 101.85,42.67 103.12,43.94 103.12,56.9 101.85,57.4
  pour Bottom (no thermals): 100.84,57.15 95.25,50.55 95.25,47.24 99.57,42.67 101.85,42.16 103.12,43.43 103.12,56.39 101.85,56.9
  pour Bottom (no thermals): 102.36,57.4 104.65,56.13 104.65,43.18 103.38,41.91 100.84,41.91 99.82,42.42 102.62,43.18 102.36,57.15
  pour Bottom (no thermals): 100.58,41.91 95.76,42.67 95.76,46.74 100.08,42.42
V_SENSE
  Bottom 1.27: R18.P$1 R27.P$1 C7.1 ADS1115BOARD.9
  pour Bottom (no thermals): 57.4,20.07 60.71,17.78 60.45,19.56 58.17,20.32

### Text on the board
tValues: POT1 10K | 9V GND | GND | GND | GND | X3 | I SET REAL | ___ | SHUNT RESISTOR | X3 | VIN | _____________________ | SHUNT | 3=D 2=G 1=S | I SET | ____ | Q2 | Bottom | GATE | __________ | - + | _______ | LOAD_IN | Electronic DC Load V2.0 - March 2016 / Copyright 2016 Dennis Cabell | GND